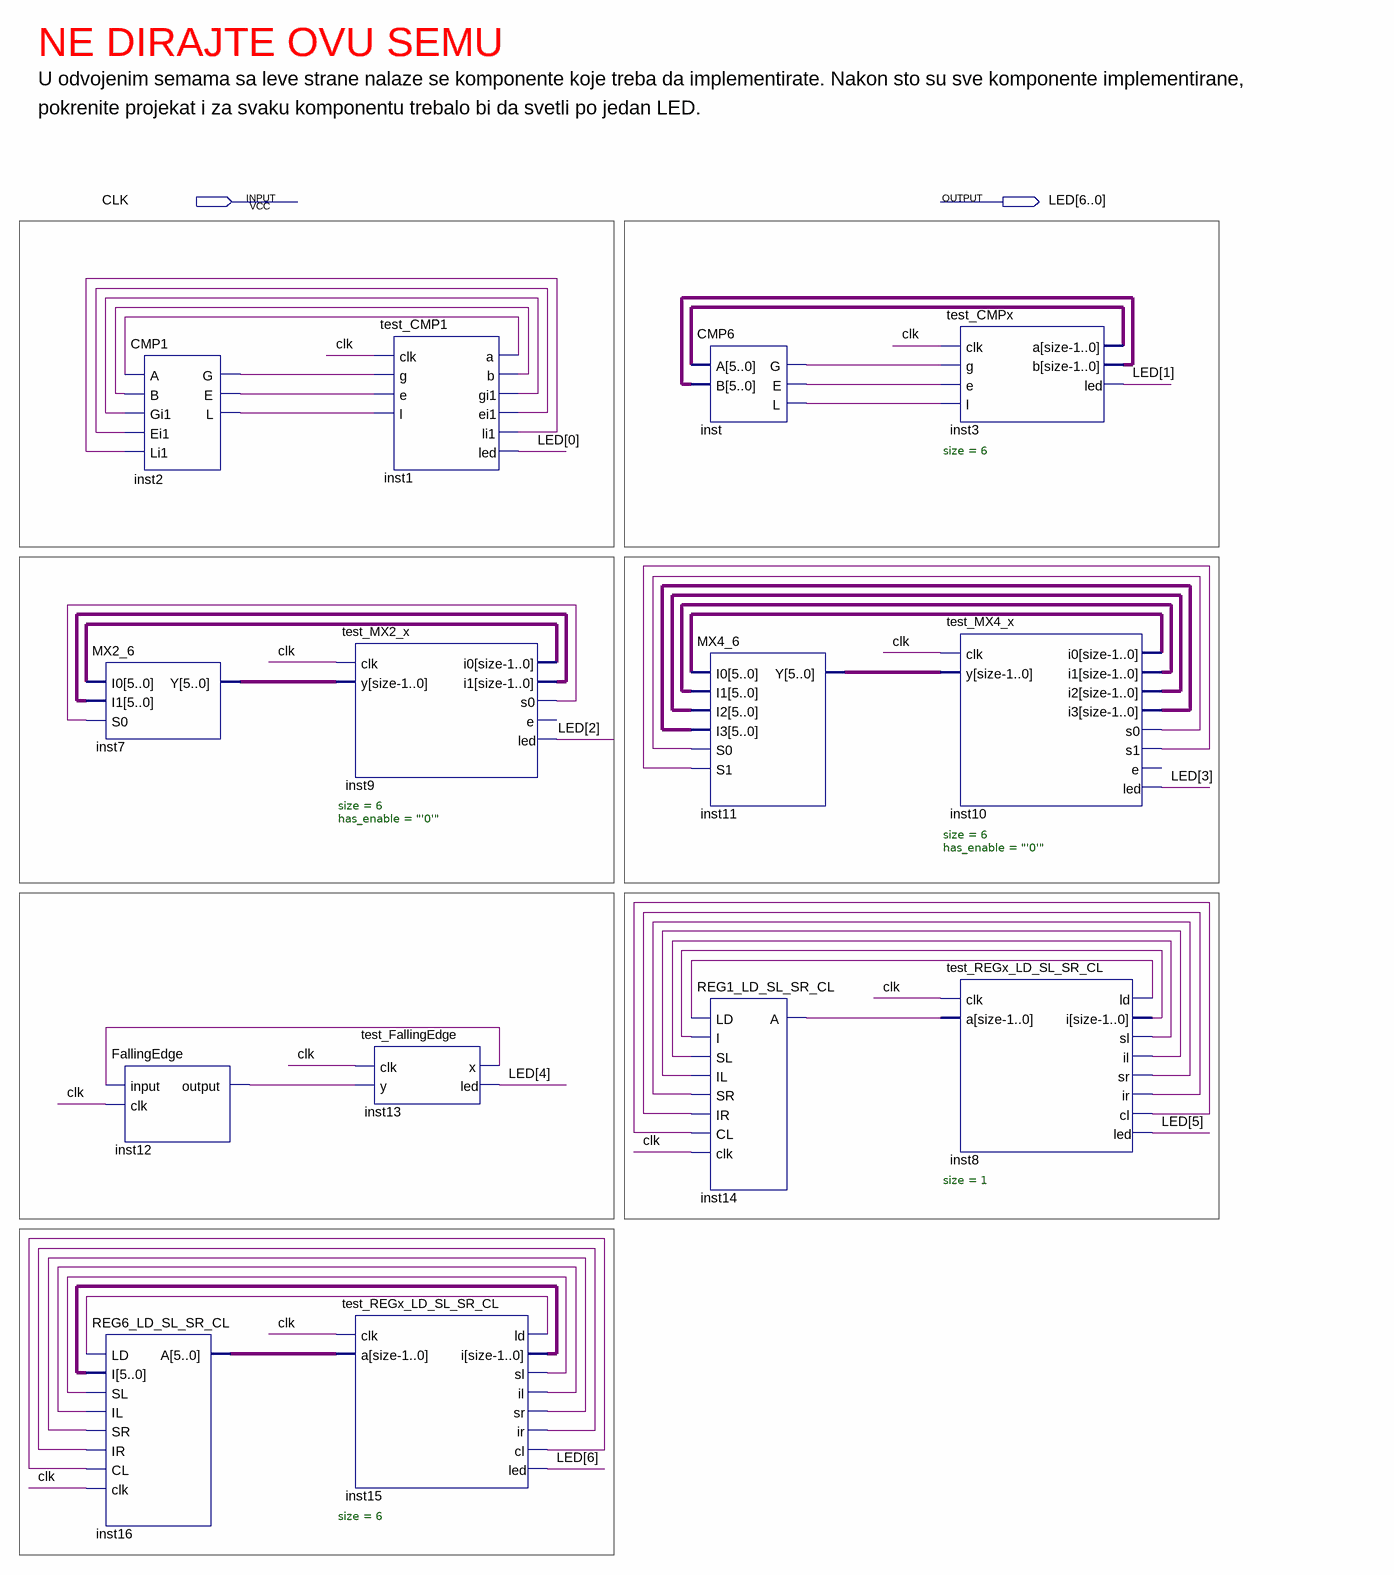
[diagram p0: schematic sheet]
// Quartus schematic PORT_AVGUST_2021_ZADATAK_1.bdf as structural Verilog: 14 symbols, 2 pins
module PORT_AVGUST_2021_ZADATAK_1 (
  input  CLK,
  output [6:0] LED
);

  wire inst1_a, inst1_b, inst1_ei1, inst1_gi1, inst1_li1, inst2_e, inst2_g, inst2_l, inst8_cl, inst8_i,
       inst8_il, inst8_ir, inst8_ld, inst8_sl, inst8_sr, inst9_s0, inst10_s0, inst10_s1, inst12_output,
       inst13_x, inst14_a, inst15_cl, inst15_il, inst15_ir, inst15_ld, inst15_sl, inst15_sr, inst_e, inst_g,
       inst_l;
  wire [5:0] inst3_a, inst3_b, inst7_y, inst9_i0, inst9_i1, inst10_i0, inst10_i1, inst10_i2, inst10_i3,
       inst11_y, inst15_i, inst16_a;

  MX2_6 inst7 (.I0(inst9_i0), .I1(inst9_i1), .S0(inst9_s0), .Y(inst7_y));
  REG6_LD_SL_SR_CL inst16 (
    .LD(inst15_ld), .I(inst15_i), .SL(inst15_sl), .IL(inst15_il), .SR(inst15_sr), .IR(inst15_ir),
    .CL(inst15_cl), .clk(CLK), .A(inst16_a));
  CMP1 inst2 (
    .A(inst1_a), .B(inst1_b), .Gi1(inst1_gi1), .Ei1(inst1_ei1), .Li1(inst1_li1), .G(inst2_g), .E(inst2_e),
    .L(inst2_l));
  FallingEdge inst12 (.\input (inst13_x), .clk(CLK), .\output (inst12_output));
  test_CMP1 inst1 (
    .clk(CLK), .g(inst2_g), .e(inst2_e), .l(inst2_l), .a(inst1_a), .b(inst1_b), .gi1(inst1_gi1),
    .ei1(inst1_ei1), .li1(inst1_li1), .led(LED[0]));
  test_MX2_x #(.size(6), .has_enable("'0'")) inst9 (
    .clk(CLK), .y(inst7_y), .i0(inst9_i0), .i1(inst9_i1), .s0(inst9_s0), .led(LED[2]));  // open: e
  test_FallingEdge inst13 (.clk(CLK), .y(inst12_output), .x(inst13_x), .led(LED[4]));
  test_REGx_LD_SL_SR_CL #(.size(6)) inst15 (
    .clk(CLK), .a(inst16_a), .ld(inst15_ld), .i(inst15_i), .sl(inst15_sl), .il(inst15_il), .sr(inst15_sr),
    .ir(inst15_ir), .cl(inst15_cl), .led(LED[6]));
  CMP6 inst (.A(inst3_a), .B(inst3_b), .G(inst_g), .E(inst_e), .L(inst_l));
  MX4_6 inst11 (
    .I0(inst10_i0), .I1(inst10_i1), .I2(inst10_i2), .I3(inst10_i3), .S0(inst10_s0), .S1(inst10_s1),
    .Y(inst11_y));
  REG1_LD_SL_SR_CL inst14 (
    .LD(inst8_ld), .I(inst8_i), .SL(inst8_sl), .IL(inst8_il), .SR(inst8_sr), .IR(inst8_ir), .CL(inst8_cl),
    .clk(CLK), .A(inst14_a));
  test_CMPx #(.size(6)) inst3 (.clk(CLK), .g(inst_g), .e(inst_e), .l(inst_l), .a(inst3_a), .b(inst3_b), .led(LED[1]));
  test_MX4_x #(.size(6), .has_enable("'0'")) inst10 (
    .clk(CLK), .y(inst11_y), .i0(inst10_i0), .i1(inst10_i1), .i2(inst10_i2), .i3(inst10_i3), .s0(inst10_s0),
    .s1(inst10_s1), .led(LED[3]));  // open: e
  test_REGx_LD_SL_SR_CL #(.size(1)) inst8 (
    .clk(CLK), .a(inst14_a), .ld(inst8_ld), .i(inst8_i), .sl(inst8_sl), .il(inst8_il), .sr(inst8_sr),
    .ir(inst8_ir), .cl(inst8_cl), .led(LED[5]));

  // Notes on the sheet:
  //   NE DIRAJTE OVU SEMU
  //   U odvojenim semama sa leve strane nalaze se komponente koje treba da implementirate. Nakon sto su sve komponente implementirane,
  //   pokrenite projekat i za svaku komponentu trebalo bi da svetli po jedan LED.
endmodule
